# Altium project SpeedGateControl.PrjPcb (part 1 of 2)
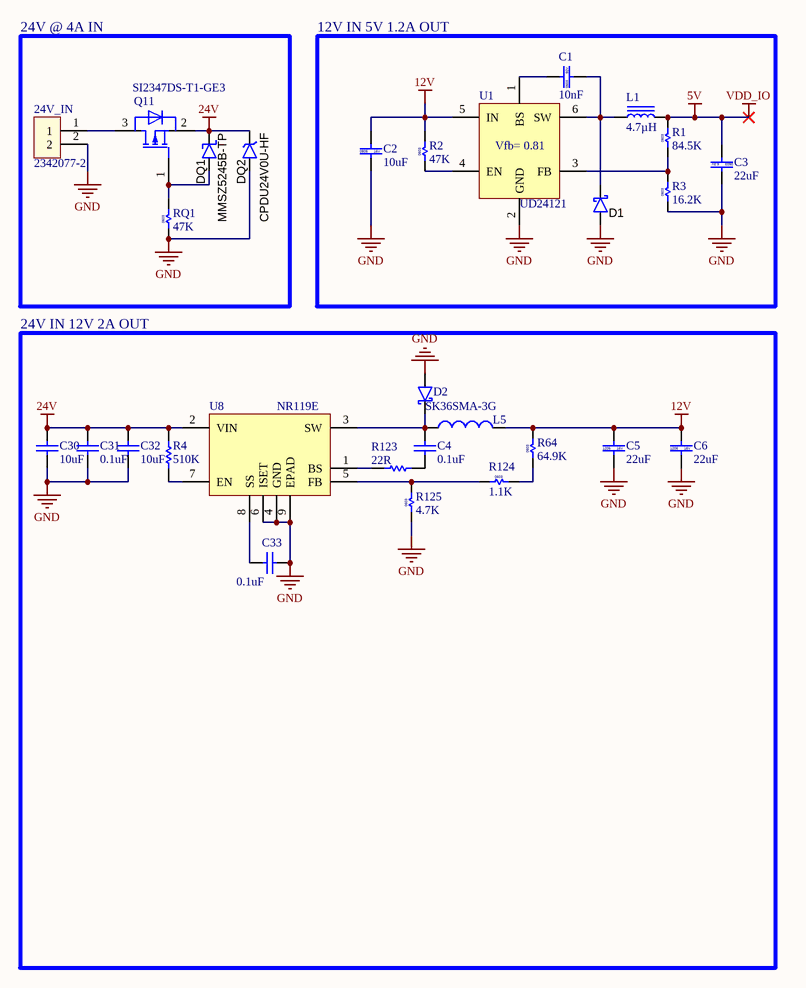
[diagram p0: 01_POWER.SchDoc]
10 sheets, 303 parts. Net scope: global (net labels, ports and power ports of the same name join across sheets).
Board file: SpeedGateControl_PCB.PcbDoc
Sheets:
  01_POWER.SchDoc
  02_CPU.SchDoc
  03_PHOTOELECTRIC_SENSOR.SchDoc
  04_GIRIS_CIKIS_EMG_BUTTONS.SchDoc
  05_FEEDBACK_OUTPUTS.SchDoc
  06_LED_OUTPUTS.SchDoc
  07_MOTOR_DRIVER_INTERFACE.SchDoc
  08_SLAVE_CARD_CONNECTOR_RJ45.SchDoc
  09_RS232.SchDoc
  10_SES.SchDoc

## Sheet 01_POWER.SchDoc
size A3

### Parts
24V_IN  2342077-2  [TERM BLOCK HDR 2POS 90DEG PITCH 3.81MM]
C1  10nF  [603C]
C2  10uF  [805C]
C3  22uF  [603C]
C4  0.1uF  [603C]
C5  22uF  [1206C]
C6  22uF  [1206C]
C30  10uF  [1206C]
C31  0.1uF  [603C]
C32  10uF  [1206C]
C33  0.1uF  [603C]
D1  1N5819HW-7-F  [SOD123]  (value not drawn)
D2  SK36SMA-3G  [DO-214AC]
DQ1  MMSZ5245B-TP  [SOD123]
DQ2  CPDU24V0U-HF  [SOD523F]
L1  4.7µH  [INDUCTOR 3mm 3mm]
L5  10uH 2.4A 59.8mOhm  [inductor_SMD6x6mm]  (value not drawn)
Q11  SI2347DS-T1-GE3  [SOT23-3]
R1  84.5K  [603R]
R2  47K  [603R]
R3  16.2K  [603R]
R4  510K  [603R]
R64  64.9K  [603R]
R123  22R  [603R]
R124  1.1K  [603R]
R125  4.7K  [603R]
RQ1  47K  [603R]
U1  UD24121  [SOT-23-6L]
U8  NR119E  [eSOIC8]

### Blocks framed on the sheet
24V @ 4A IN: 24V_IN DQ1 DQ2 Q11 RQ1
12V IN 5V 1.2A OUT: C1-C3 D1 L1 R1-R3 U1
24V IN 12V 2A OUT: C4-C6 C30-C33 D2 L5 R4 R64 R123-R125 U8

### Nets
5V: C3.2 L1.2 R1.2  [also labelled VDD_IO]
12V: C2.1 C5.1 C6.1 L5.2 R2.2 R64.2 U1.5(IN)
24V: C30.2 C31.2 C32.2 DQ1.2(K) DQ2.2 Q11.2(S) R4.2 U8.2(VIN)
GND: 24V_IN.2 C2.2 C3.1 C5.2 C6.2 C30.1 C31.1 C32.1 C33.2 D1.1(A) D2.1(A) DQ2.1 R3.1 R125.1 RQ1.1 U1.2(GND) U8.4(GND) U8.6(ISET) U8.9(EPAD)
Net24V_IN_1: 24V_IN.1 Q11.3(D)
NetC1_1: C1.1 U1.1(BS)
NetC1_2: C1.2 D1.2(K) L1.1 U1.6(SW)
NetC4_1: C4.1 D2.2(K) L5.1 U8.3(SW)
NetC4_2: C4.2 R123.1
NetC33_1: C33.1 U8.8(SS)
NetDQ1_1: DQ1.1(A) Q11.1(G) RQ1.2
NetR1_1: R1.1 R3.2 U1.3(FB)
NetR2_1: R2.1 U1.4(EN)
NetR4_1: R4.1 U8.7(EN)
NetR64_1: R64.1 R124.2
NetR123_2: R123.2 U8.1(BS)
NetR124_1: R124.1 R125.2 U8.5(FB)

### Notes on the sheet
- (in symbol CAP CER 22UF 6.3V X5R 0603) 0603
- (in symbol CAP_CER_10nF_50V_%5_ X7R_ 0603) 0603
- (in symbol CAP_CER_10uF_16V_%10_ X5R_ 0805) 0805
- (in symbol CAP_CER_22uF_16V_%20_ X5R_ 1206) 1206
- (in symbol IC REG BUCK ADJ 1.2A SOT23-6 UD24121) Vfb= 0.81
- (in symbol RES 64.9K OHM 1% 1/10W 0603) 0603
- (in symbol RES SMD 4.7K OHM 1% 1/10W 0603) 0603
- (in symbol RES_1.1K_OHM_%1_0.1W_0603) 0603
- (in symbol RES_16.2K_OHM_%1_0.1W_0603) 0603
- (in symbol RES_47K_OHM_%5_0.1W_0603) 0603
- (in symbol RES_84.5K_OHM_%1_0.1W_0603) 0603

### Library data of the parts
24V_IN = TERM BLOCK HDR 2POS 90DEG 3.81MM: 2 Position Terminal Block Header, Male Pins, Shrouded (4 Side) 0.150" (3.81mm) 90°, Right Angle - Through Hole; Manufacturer: TE Connectivity AMP Connectors; Contact Tail Length: 0.075" (1.90mm); Digi-Key Part Number: A145321-ND; Value: 2342077-2; Pitch: 0.150" (3.81mm); Header Orientation: 90°, Right Angle; Insulation Height: 0.285" (7.25mm)
C1 = CAP_CER_10nF_50V_%5_ X7R_ 0603: 10nF ±5% 50V Ceramic Capacitor X7R 0603 (1608 Metric); Manufacturer: Yageo; Manufacturer Part Number: CC0603JRX7R9BB103; Value: 10nF; Digi-Key Part Number: 311-1778-2-ND; Tolerance: ±5%; Voltage - Rated: 50V; Temperature Coefficient: X7R; Operating Temperature: -55°C ~ 125°C; Applications: General Purpose; Package / Case: 0603 (1608 Metric); Size / Dimension: 0.063" L x 0.032" W (1.60mm x 0.80mm); Thickness (Max): 0.035" (0.90mm)
C2 = CAP_CER_10uF_16V_%10_ X5R_ 0805: 10µF ±10% 16V Ceramic Capacitor X6S 0805 (2012 Metric); Manufacturer: Murata Electronics North America; Manufacturer Part Number: GRM21BC81C106KA73L; Temperature Coefficient: XS6; Value: 10uF; Digi-Key Part Number: 490-5519-1-ND; Tolerance: ±10%; Voltage - Rated: 16V; Operating Temperature: -55°C ~ 85°C; Applications: General Purpose; Package / Case: 0805 (2012 Metric); Size / Dimension: 0.079" L x 0.049" W (2.00mm x 1.25mm); Thickness (Max): 0.037" (0.95mm); Price-1: 0.24000; Price-10: 0.16100; Price-100: 0.08140; Price-1000: 0.04928
C3 = CAP CER 22UF 6.3V X5R 0603: 22 µF ±20% 6.3V Ceramic Capacitor X5R 0603 (1608 Metric); Manufacturer: CAL-CHIP ELECTRONICS, INC.; Manufacturer Part Number: GMC10X5R226M6R3NT; Value: 22uF; Digi-Key Part Number: 2571-GMC10X5R226M6R3NTTR-ND; Tolerance: ±20%; Voltage - Rated: 6.3V; Temperature Coefficient: X5R; Operating Temperature: -55°C ~ 85°C; Applications: General Purpose; Package / Case: 0603 (1608 Metric)
C4 C31 C33 = CAP CER 0.1UF 100V X7R 0603: 0.1 µF ±10% 100V Ceramic Capacitor X7R 0603 (1608 Metric); Manufacturer: Venkel; Manufacturer Part Number: C0603X7R101-104KNP; Value: 0.1uF; Digi-Key Part Number: 2679-C0603X7R101-104KNPTR-ND; Tolerance: ±10%; Voltage - Rated: 100V; Temperature Coefficient: X7R; Operating Temperature: -55°C ~ 125°C; Applications: General Purpose; Package / Case: 0603 (1608 Metric)
C5 C6 = CAP_CER_22uF_16V_%20_ X5R_ 1206: 22µF ±20% 16V Ceramic Capacitor X5R 1206 (3216 Metric); Manufacturer: Samsung Electro-Mechanics; Manufacturer Part Number: CL31A226MOCLNNC; Value: 22uF; Digi-Key Part Number: 1276-2728-1-ND; Tolerance: ±20%; Voltage - Rated: 16V; Temperature Coefficient: X5R; Operating Temperature: -55°C ~ 85°C; Applications: General Purpose; Package / Case: 1206 (3216 Metric); Size / Dimension: 0.126" L x 0.063" W (3.20mm x 1.60mm); Thickness (Max): 0.037" (0.95mm); Features: Low Profile
C30 C32 = CAP_CER_10uF_50V_%20_ X5R_ 1206: 10µF ±20% 50V Ceramic Capacitor X5R 1206 (3216 Metric); Manufacturer: Samsung Electro-Mechanics; Manufacturer Part Number: CL31A106MBHNNNE; Value: 10uF; Digi-Key Part Number: 1276-6736-1-ND; Tolerance: ±20%; Voltage - Rated: 50V; Temperature Coefficient: X5R; Operating Temperature: -55°C ~ 85°C; Applications: General Purpose; Package / Case: 1206 (3216 Metric); Size / Dimension: 0.126" L x 0.063" W (3.20mm x 1.60mm); Thickness (Max): 0.071" (1.80mm); Price-1: 0.24000; Price-10: 0.16100; Price-100: 0.08140; Price-1000: 0.04928
D1 = DIODE_SCHOTTKY_1N5819_1A_40V: Diode Schottky 40V 1A Surface Mount SOD-123; Manufacturer: Diodes Inc; Material: Si; Voltage - Forward (Vf) (Max) @ If: 450mV @ 1A; Speed: Fast Recovery =< 500ns, > 200mA (Io); Current - Reverse Leakage @ Vr: 1mA @ 40V; Capacitance @ Vr, F: 60pF @ 4V, 1MHz; Package / Case: SOD123; Diode Type: Schottky; Manufacturer Part Number: 1N5819HW-7-F; Voltage - DC Reverse (Vr) (Max): 40V; Operating Temperature - Junction: -65°C ~ 125°C; Digi-Key Part Number: 1N5819HW-FDITR-ND; Value: 1N5819HW-7-F
D2 = DIODE_SCHOTTKY SMA 60V 3A: Diode Schottky 60 V 3A Surface Mount SMA (DO-214AC); pin to pad: 1>A 2>K; Voltage - Forward (Vf) (Max) @ If: 550 mV @ 3 A; Voltage - DC Reverse (Vr) (Max): 60V; Speed: Fast Recovery =< 500ns, > 200mA (Io); Current - Reverse Leakage @ Vr: 50 µA @ 60 V; Value: SK36SMA-3G; Digi-Key Part Number: 2796-SK36SMA-3GTR-ND; Package / Case: DO-214AC, SMA; Diode Type: Schottky; Operating Temperature - Junction: -50°C ~ 150°C; Current - Average Rectified (Io): 3A
DQ1 = DIODE ZENER 15V 500MW SOD123 MMSZ5245B-TP: Zener Diode 15 V 500 mW ±5% Surface Mount SOD-123; Manufacturer: Micro Commercial Co; Voltage - Zener (Nom) (Vz): 15 V; Power - Max: 500 mW; Impedance (Max) (Zzt): 16 Ohms; Current - Reverse Leakage @ Vr: 100 nA @ 11 V; Voltage - Forward (Vf) (Max) @ If: 900 mV @ 10 mA; Digi-Key Part Number: MMSZ5245B-TPMSCT-ND; Manufacturer Part Number: MMSZ5245B-TP; Tolerance: ±5%; Operating Temperature: -55°C ~ 150°C; Package / Case: SOD-123; Value: MMSZ5245B-TP
DQ2 = TVS DIODE 24VWM 50V 0603/SOD523F CPDU24V0U-HF: 50V Clamp 3A (8/20µs) Ipp Tvs Diode Surface Mount 0603/SOD-523F; Manufacturer: Comchip Technology; Voltage - Reverse Standoff (Typ): 24V (Max); Voltage - Breakdown (Min): 26.5V; Power - Peak Pulse: 150W; Power Line Protection: No; Unidirectional Channels: 1; Digi-Key Part Number: 641-1679-1-ND; Manufacturer Part Number: CPDU24V0U-HF; Type: Zener; Voltage - Clamping (Max) @ Ipp: 50V; Operating Temperature: -55°C ~ 125°C (TJ); Package / Case: 0603/SOD-523F; Value: CPDU24V0U-HF
L1 = FIXED IND 4.7UH 1A 120 MOHM 3mm x 3mm SMD LQH3NPN4R7MMEL: 4.7 µH Shielded Drum Core, Wirewound Inductor 1 A 120mOhm Max 1212 (3030 Metric); Manufacturer: Murata Electronics; Current Rating: 1A; Material - Core: Ferrite; Current - Saturation (Isat): 1.3A; Digi-Key Part Number: 490-15954-1-ND; Inductance: 4.7µH; Package / Case: 1212 (3030 Metric); DC Resistance (DCR): 120mOhm Max; Size / Dimension: 0.118" L x 0.118" W (3.00mm x 3.00mm); Height - Seated (Max): 0.059" (1.50mm); Type: Drum Core, Wirewound
L5 = FIXED IND 10UH 2.4A 59.8MOHM SMD: 10 µH Shielded Wirewound Inductor 2.4 A 59.8mOhm Max Nonstandard; Manufacturer: Taiyo Yuden; Manufacturer Part Number: NRS6045T100MMGK; Material - Core: Ferrite; Tolerance: ±20%; Frequency - Self Resonan: 12MHz; Current - Saturation: 3.1A; Frequency - Test: 100 kHz; Inductance: 10 µH; Operating Temperature: -55°C ~ 125°C; Package / Case: Nonstandard; Height (Max): 0.177" (4.50mm); Size / Dimension: 0.236" L x 0.236" W (6.00mm x 6.00mm); Digi-Key Part Number: 587-2946-1-ND; DC Resistance (DCR) (Max): 59.8mOhm; Value: 10uH 2.4A 59.8mOhm; Current Rating (Max): 2.4A; Shielding: Shielded
Q11 = MOSFET P-CH 30V 5A SOT23-3 SI2347DS-T1-GE3: P-Channel 30 V 5A (Tc) 1.7W (Tc) Surface Mount SOT-23-3 (TO-236); Manufacturer: Vishay Siliconix; Drain to Source Voltage (Vdss): 30 V; Current - Continuous Drain (Id) @ 25°C: 5A (Tc); Drive Voltage (Max Rds On, Min Rds On): 4.5V, 10V; Rds On (Max) @ Id, Vgs: 42mOhm @ 3.8A, 10V; Vgs (Max): ±20V; Digi-Key Part Number: SI2347DS-T1-GE3CT-ND; Value: SI2347DS-T1-GE3; Power Dissipation (Max): 1.7W (Tc); Operating Temperature: -55°C ~ 150°C (TJ); Package / Case: TO-236-3, SC-59, SOT-23-3
R1 = RES_84.5K_OHM_%1_0.1W_0603: 84.5 kOhms ±1% 0.1W, 1/10W Chip Resistor 0603 (1608 Metric) Moisture Resistant Thick Film; Manufacturer: Yageo; Manufacturer Part Number: RC0603FR-0784K5L; Temperature Coefficient: ±100ppm/°C; Value: 84.5K; Digi-Key Part Number: 311-84.5KHRCT-ND; Tolerance: ±1%; Power (Watts): 0.1W, 1/10W; Composition: Thick Film; Operating Temperature: -55°C ~ 155°C; Package / Case: 0603 (1608 Metric); Size / Dimension: 0.063" L x 0.032" W (1.60mm x 0.80mm); Height - Seated (Max): 0.022" (0.55mm); Features: Moisture Resistant
R2 RQ1 = RES_47K_OHM_%5_0.1W_0603: 47 kOhms ±5% 0.1W, 1/10W Chip Resistor 0603 (1608 Metric) Moisture Resistant Thick Film; Manufacturer: Yageo; Manufacturer Part Number: RC0603JR-0747KL; Temperature Coefficient: ±100ppm/°C; Value: 47K; Digi-Key Part Number: 311-47KGRTR-ND; Tolerance: ±5%; Power (Watts): 0.1W, 1/10W; Composition: Thick Film; Operating Temperature: -55°C ~ 155°C; Package / Case: 0603 (1608 Metric); Size / Dimension: 0.063" L x 0.032" W (1.60mm x 0.80mm); Height - Seated (Max): 0.022" (0.55mm); Features: Moisture Resistant
R3 = RES_16.2K_OHM_%1_0.1W_0603: 16.2 kOhms ±1% 0.1W, 1/10W Chip Resistor 0603 (1608 Metric) Moisture Resistant Thick Film; Manufacturer: Yageo; Manufacturer Part Number: RC0603FR-0716K2L; Temperature Coefficient: ±100ppm/°C; Value: 16.2K; Digi-Key Part Number: 311-16.2KHRTR-ND; Tolerance: ±1%; Power (Watts): 0.1W, 1/10W; Composition: Thick Film; Operating Temperature: -55°C ~ 155°C; Package / Case: 0603 (1608 Metric); Size / Dimension: 0.063" L x 0.032" W (1.60mm x 0.80mm); Height - Seated (Max): 0.022" (0.55mm); Features: Moisture Resistant
R4 = RES 510K OHM 5% 1/10W 0603: 510 kOhms ±5% 0.1W, 1/10W Chip Resistor 0603 (1608 Metric) Automotive AEC-Q200, Moisture Resistant Thick Film; Manufacturer: KOA Speer Electronics, Inc.; Manufacturer Part Number: RK73B1JTTD514J; Temperature Coefficient: ±200ppm/°C; Value: 510K; Digi-Key Part Number: 2019-RK73B1JTTD514JTR-ND; Tolerance: ±5%; Power (Watts): 0.1W, 1/10W; Composition: Thick Film; Operating Temperature: -55°C ~ 155°C; Package / Case: 0603 (1608 Metric); Size / Dimension: 0.063" L x 0.032" W (1.60mm x 0.80mm); Height - Seated (Max): 0.022" (0.55mm); Features: Automotive AEC-Q200, Moisture Resistant
R64 = RES 64.9K OHM 1% 1/10W 0603: 64.9 kOhms ±1% 0.1W, 1/10W Chip Resistor 0603 (1608 Metric) Moisture Resistant Thick Film; Manufacturer: YAGEO; Manufacturer Part Number: RC0603FR-0764K9L; Temperature Coefficient: ±100ppm/°C; Value: 64.9K; Digi-Key Part Number: 311-64.9KHRCT-ND; Tolerance: ±1%; Power (Watts): 0.1W, 1/10W; Composition: Thick Film; Operating Temperature: -55°C ~ 155°C; Package / Case: 0603 (1608 Metric); Size / Dimension: 0.063" L x 0.032" W (1.60mm x 0.80mm); Height - Seated (Max): 0.022" (0.55mm); Features: Moisture Resistant
R123 = RES_22 OHM 5% 1/10W 0603: 22 Ohms ±5% 0.1W, 1/10W Chip Resistor 0603 (1608 Metric) Automotive AEC-Q200 Thick Film; Temperature Coefficient: ±200ppm/°C; Value: 22R; Digi-Key Part Number: RMCF0603JT22R0TR-ND; Tolerance: ±5%; Power (Watts): 0.1W, 1/10W; Operating Temperature: -55°C ~ 155°C; Package / Case: 0603 (1608 Metric)
R124 = RES_1.1K_OHM_%1_0.1W_0603: 1.1 kOhms ±1% 0.1W, 1/10W Chip Resistor 0603 (1608 Metric) Moisture Resistant Thick Film; Manufacturer: Yageo; Manufacturer Part Number: RC0603FR-071K1L; Temperature Coefficient: ±100ppm/°C; Value: 1.1K; Digi-Key Part Number: 311-1.10KHRCT-ND; Tolerance: ±1%; Power (Watts): 0.1W, 1/10W; Composition: Thick Film; Operating Temperature: -55°C ~ 155°C; Package / Case: 0603 (1608 Metric); Size / Dimension: 0.063" L x 0.032" W (1.60mm x 0.80mm); Height - Seated (Max): 0.022" (0.55mm); Features: Moisture Resistant
R125 = RES SMD 4.7K OHM 1% 1/10W 0603: 4.7 kOhms ±1% 0.1W, 1/10W Chip Resistor 0603 (1608 Metric)  Thick Film; Temperature Coefficient: ±100ppm/°C; Value: 4.7K; Digi-Key Part Number: 311-4.70KHRCT-ND; Tolerance: ±1%; Power (Watts): 0.1W, 1/10W; Operating Temperature: -55°C ~ 155°C; Package / Case: 0603 (1608 Metric)
U1 = IC REG BUCK ADJ 1.2A SOT23-6 UD24121: 1.2A, 24V, 1.4MHz STEP-DOWN CONVERTER; Manufacturer: UNISONIC TECHNOLOGIES CO., LTD; Voltage - Input (Max): 4.5 ~ 24V; Voltage - Output (Max): 0.81 ~ 15V; Control Features: Enable; Voltage - Input (Min): 4.5V; Number of Outputs: 1; Output Type: Adjustable; Digi-Key Part Number: https://ozdisan.com/integrated-circuits-ics/power-management-ics/dc-dc-switching-voltage-regulators/UD24121G-AG6-R/498894; Manufacturer Part Number: UD24121; Current - Output: 1.2A; Operating Temperature: -40°C ~ 85°C (TA); Package / Case: SOT-23-6; Supplier Device Package: SOT-23-6; Value: UD24121; Frequency - Switching: 1.4MHz; Function: Step-Down
U8 = IC REG BUCK ADJUSTABLE 2A 8SOIC NR119E: Buck Switching Regulator IC Positive Adjustable 0.8V 1 Output 2A 8-SOIC (0.154", 3.90mm Width) Exposed Pad; Manufacturer: Sanken; Voltage - Input (Min): 6.5V; Voltage - Input (Max): 31V; Voltage - Output (Max): 24V; Frequency - Switching: 364kHz; Function: Step-Down; Digi-Key Part Number: NR119ECT-ND; Manufacturer Part Number: NR119E; Voltage - Output (Min/Fixed): 0.8V; Current - Output: 2A; Operating Temperature: -40°C ~ 85°C (TA); Package / Case: 8-SOIC (0.154", 3.90mm Width) Exposed Pad; Supplier Device Package: 8-SOIC-EP; Value: NR119E

## Sheet 02_CPU.SchDoc
size A3
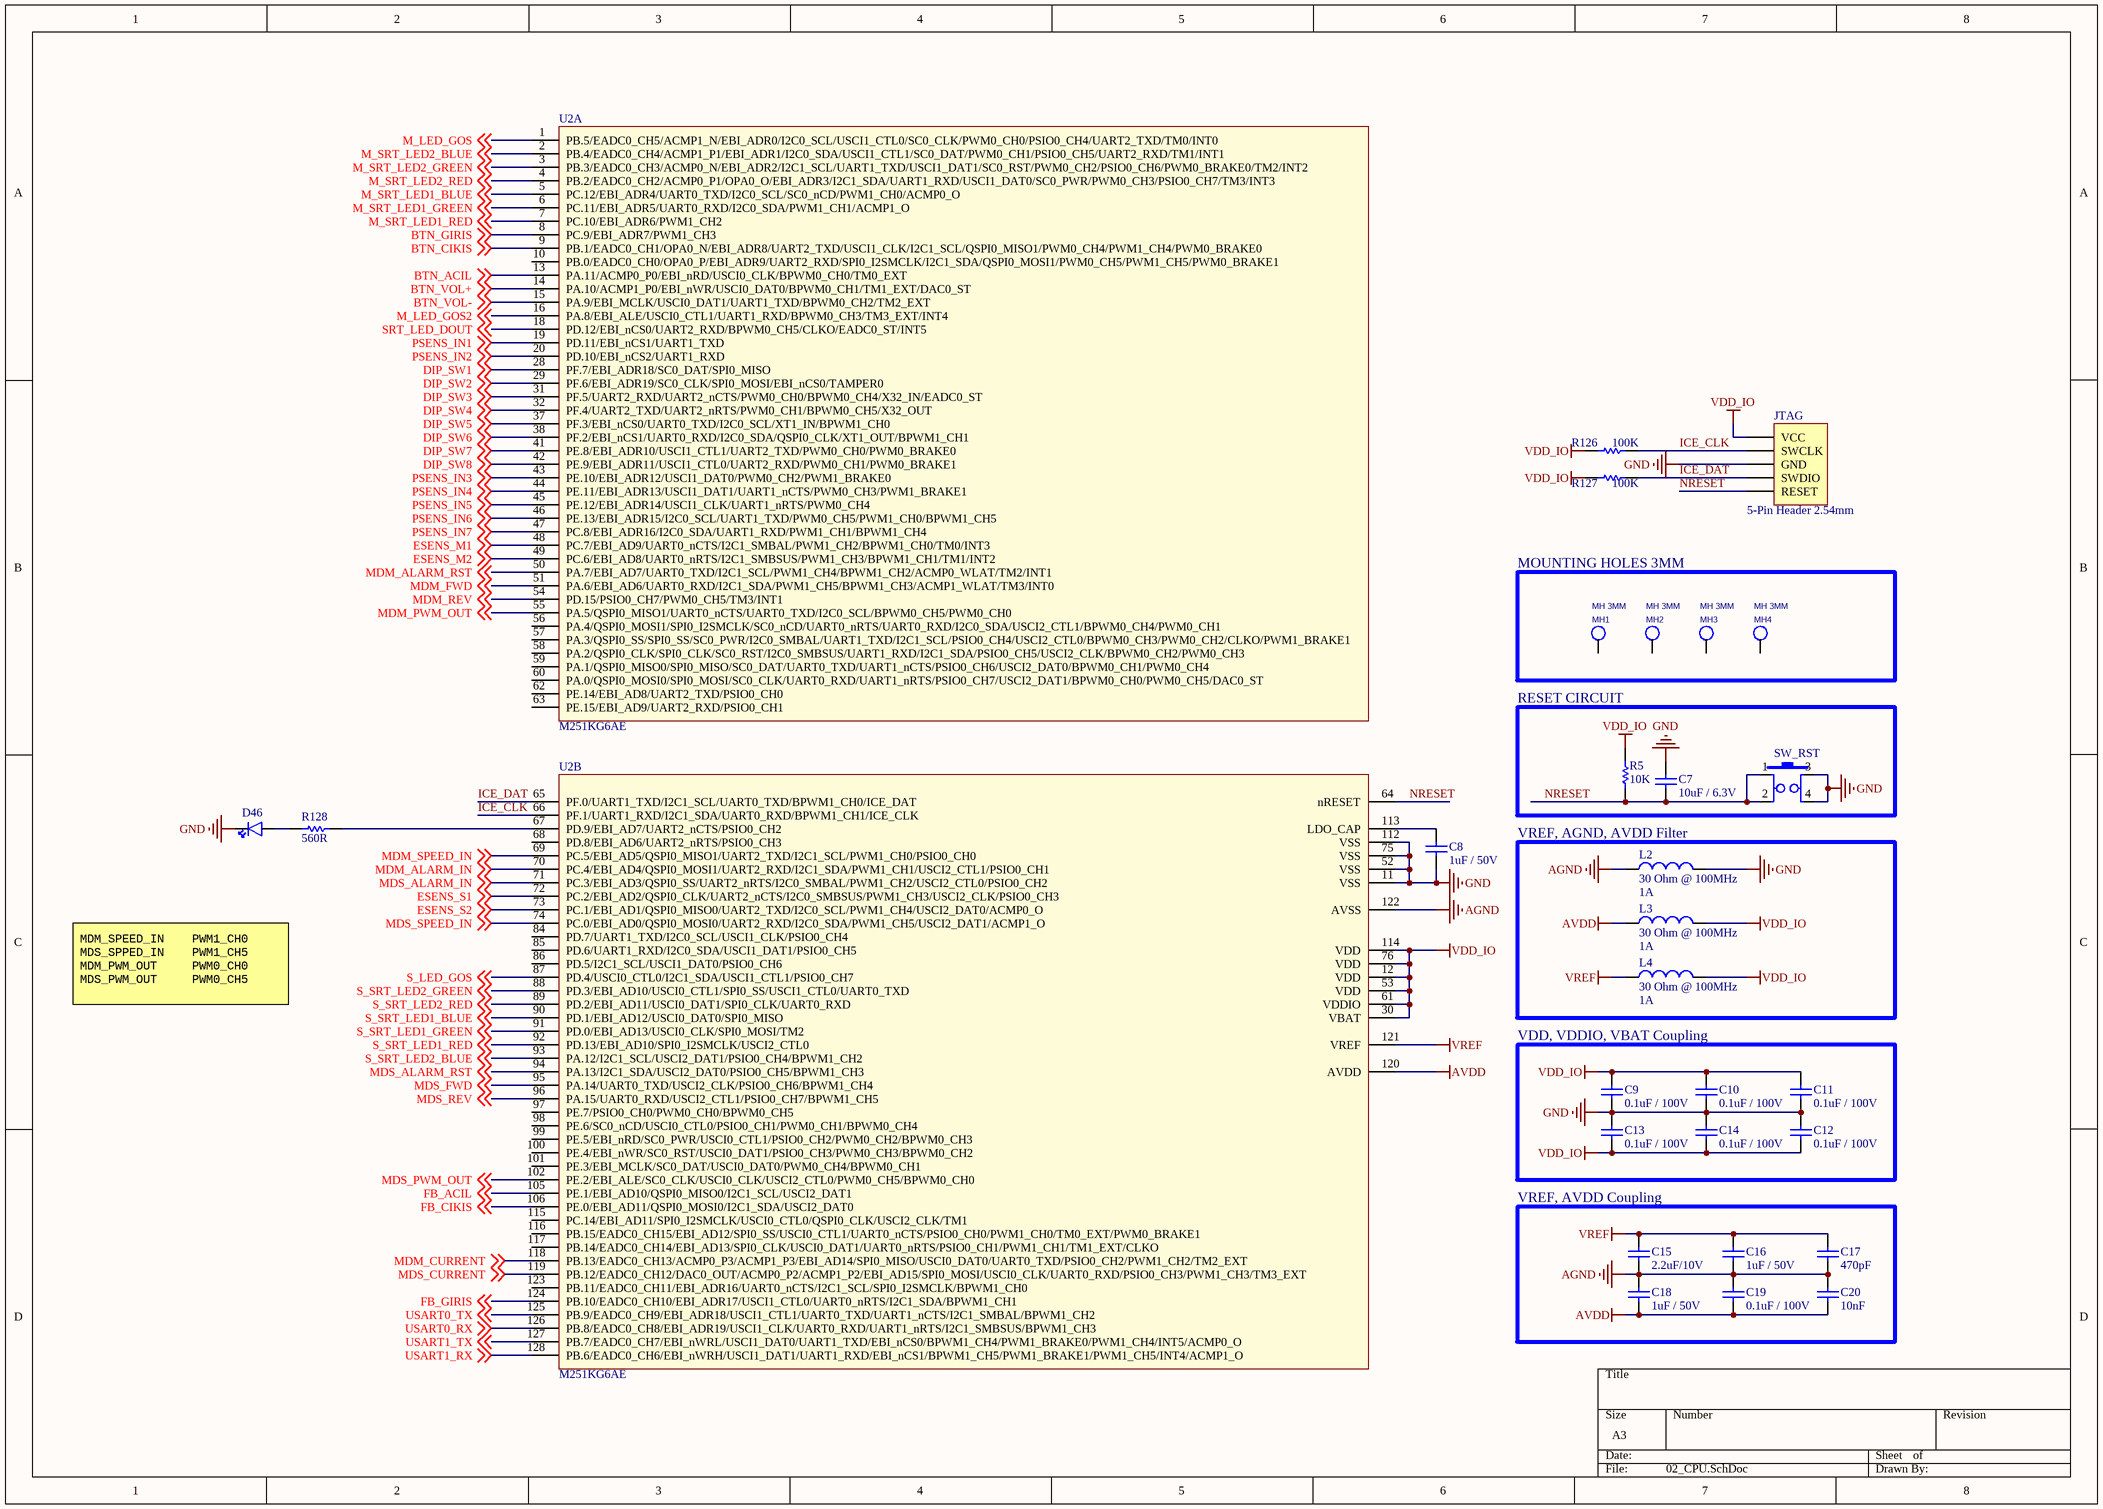
[diagram p1: 02_CPU.SchDoc]

### Parts
C7  10uF / 6.3V  [603C]
C8  1uF / 50V  [603C]
C9  0.1uF / 100V  [603C]
C10  0.1uF / 100V  [603C]
C11  0.1uF / 100V  [603C]
C12  0.1uF / 100V  [603C]
C13  0.1uF / 100V  [603C]
C14  0.1uF / 100V  [603C]
C15  2.2uF/10V  [603C]
C16  1uF / 50V  [603C]
C17  470pF  [603C]
C18  1uF / 50V  [603C]
C19  0.1uF / 100V  [603C]
C20  10nF  [603C]
D46  led_green  [805LED]  (value not drawn)
JTAG  5-Pin Header 2.54mm  [HDR1X5]  (no BOM)
L2  Current Rating (Max): 1A  [603L]  (hidden comment: 30 Ohm @ 100MHz)
L3  Current Rating (Max): 1A  [603L]  (hidden comment: 30 Ohm @ 100MHz)
L4  Current Rating (Max): 1A  [603L]  (hidden comment: 30 Ohm @ 100MHz)
MH1  MH 3MM  [MH 3.0MM HOLE 5MM PAD]  (no BOM)
MH2  MH 3MM  [MH 3.0MM HOLE 5MM PAD]  (no BOM)
MH3  MH 3MM  [MH 3.0MM HOLE 5MM PAD]  (no BOM)
MH4  MH 3MM  [MH 3.0MM HOLE 5MM PAD]  (no BOM)
R5  10K  [603R]
R126  100K  [603R]
R127  100K  [603R]
R128  560R  [603R]
SW_RST  switch tactile  [SW_TACTILE_6X6mm SMT]  (value not drawn)
U2  M251KG6AE  [TSQFP40P1600X1600X160-128N]  (parts A,B of 2)

### Blocks framed on the sheet
MOUNTING HOLES 3MM: MH1-MH4
RESET CIRCUIT: C7 R5 SW_RST
VREF, AGND, AVDD Filter: L2-L4
VDD, VDDIO, VBAT Coupling: C9-C14
VREF, AVDD Coupling: C15-C20

### Nets
AGND: C15.1 C16.1 C17.1 C18.2 C19.2 C20.2 L2.1 U2.122(AVSS)
AVDD: C18.1 C19.1 C20.1 L3.1 U2.120(AVDD)
GND: C7.1 C8.1 C9.1 C10.1 C11.1 C12.1 C13.2 C14.2 D46.2(K) JTAG.3(GND) L2.2 SW_RST.3 SW_RST.4 U2.11(VSS) U2.52(VSS) U2.75(VSS) U2.112(VSS)
VDD_IO: C9.2 C10.2 C11.2 C12.2 C13.1 C14.1 JTAG.1(VCC) L3.2 L4.2 R5.2 R126.1 R127.1 U2.12(VDD) U2.30(VBAT) U2.53(VDD) U2.61(VDDIO) U2.76(VDD) U2.114(VDD)  [project net 5V]
VREF: C15.2 C16.2 C17.2 L4.1 U2.121(VREF)
BTN_ACIL: U2.13(PA.11/ACMP0_P0/EBI_nRD/USCI0_CLK/BPWM0_CH0/TM0_EXT) ; off-sheet BTN_ACIL
BTN_CIKIS: U2.9(PB.1/EADC0_CH1/OPA0_N/EBI_ADR8/UART2_TXD/USCI1_CLK/I2C1_SCL/QSPI0_MISO1/PWM0_CH4/PWM1_CH4/PWM0_BRAKE0) ; off-sheet BTN_CIKIS
BTN_GIRIS: U2.8(PC.9/EBI_ADR7/PWM1_CH3) ; off-sheet BTN_GIRIS
BTN_VOL+: U2.14(PA.10/ACMP1_P0/EBI_nWR/USCI0_DAT0/BPWM0_CH1/TM1_EXT/DAC0_ST) ; off-sheet BTN_VOL+
BTN_VOL-: U2.15(PA.9/EBI_MCLK/USCI0_DAT1/UART1_TXD/BPWM0_CH2/TM2_EXT) ; off-sheet BTN_VOL-
DIP_SW1: U2.28(PF.7/EBI_ADR18/SC0_DAT/SPI0_MISO) ; off-sheet DIP_SW1
DIP_SW2: U2.29(PF.6/EBI_ADR19/SC0_CLK/SPI0_MOSI/EBI_nCS0/TAMPER0) ; off-sheet DIP_SW2
DIP_SW3: U2.31(PF.5/UART2_RXD/UART2_nCTS/PWM0_CH0/BPWM0_CH4/X32_IN/EADC0_ST) ; off-sheet DIP_SW3
DIP_SW4: U2.32(PF.4/UART2_TXD/UART2_nRTS/PWM0_CH1/BPWM0_CH5/X32_OUT) ; off-sheet DIP_SW4
DIP_SW5: U2.37(PF.3/EBI_nCS0/UART0_TXD/I2C0_SCL/XT1_IN/BPWM1_CH0) ; off-sheet DIP_SW5
DIP_SW6: U2.38(PF.2/EBI_nCS1/UART0_RXD/I2C0_SDA/QSPI0_CLK/XT1_OUT/BPWM1_CH1) ; off-sheet DIP_SW6
DIP_SW7: U2.41(PE.8/EBI_ADR10/USCI1_CTL1/UART2_TXD/PWM0_CH0/PWM0_BRAKE0) ; off-sheet DIP_SW7
DIP_SW8: U2.42(PE.9/EBI_ADR11/USCI1_CTL0/UART2_RXD/PWM0_CH1/PWM0_BRAKE1) ; off-sheet DIP_SW8
ESENS_M1: U2.48(PC.7/EBI_AD9/UART0_nCTS/I2C1_SMBAL/PWM1_CH2/BPWM1_CH0/TM0/INT3) ; off-sheet ESENS_M1
ESENS_M2: U2.49(PC.6/EBI_AD8/UART0_nRTS/I2C1_SMBSUS/PWM1_CH3/BPWM1_CH1/TM1/INT2) ; off-sheet ESENS_M2
ESENS_S1: U2.72(PC.2/EBI_AD2/QSPI0_CLK/UART2_nCTS/I2C0_SMBSUS/PWM1_CH3/USCI2_CLK/PSIO0_CH3) ; off-sheet ESENS_S1
ESENS_S2: U2.73(PC.1/EBI_AD1/QSPI0_MISO0/UART2_TXD/I2C0_SCL/PWM1_CH4/USCI2_DAT0/ACMP0_O) ; off-sheet ESENS_S2
FB_ACIL: U2.105(PE.1/EBI_AD10/QSPI0_MISO0/I2C1_SCL/USCI2_DAT1) ; off-sheet FB_ACIL
FB_CIKIS: U2.106(PE.0/EBI_AD11/QSPI0_MOSI0/I2C1_SDA/USCI2_DAT0) ; off-sheet FB_CIKIS
FB_GIRIS: U2.124(PB.10/EADC0_CH10/EBI_ADR17/USCI1_CTL0/UART0_nRTS/I2C1_SDA/BPWM1_CH1) ; off-sheet FB_GIRIS
ICE_CLK: JTAG.2(SWCLK) R126.2 U2.66(PF.1/UART1_RXD/I2C1_SDA/UART0_RXD/BPWM1_CH1/ICE_CLK)
ICE_DAT: JTAG.4(SWDIO) R127.2 U2.65(PF.0/UART1_TXD/I2C1_SCL/UART0_TXD/BPWM1_CH0/ICE_DAT)
M_LED_GOS: U2.1(PB.5/EADC0_CH5/ACMP1_N/EBI_ADR0/I2C0_SCL/USCI1_CTL0/SC0_CLK/PWM0_CH0/PSIO0_CH4/UART2_TXD/TM0/INT0) ; off-sheet M_LED_GOS
M_LED_GOS2: U2.16(PA.8/EBI_ALE/USCI0_CTL1/UART1_RXD/BPWM0_CH3/TM3_EXT/INT4) ; off-sheet M_LED_GOS2
M_SRT_LED1_BLUE: U2.5(PC.12/EBI_ADR4/UART0_TXD/I2C0_SCL/SC0_nCD/PWM1_CH0/ACMP0_O) ; off-sheet M_SRT_LED1_BLUE
M_SRT_LED1_GREEN: U2.6(PC.11/EBI_ADR5/UART0_RXD/I2C0_SDA/PWM1_CH1/ACMP1_O) ; off-sheet M_SRT_LED1_GREEN
M_SRT_LED1_RED: U2.7(PC.10/EBI_ADR6/PWM1_CH2) ; off-sheet M_SRT_LED1_RED
M_SRT_LED2_BLUE: U2.2(PB.4/EADC0_CH4/ACMP1_P1/EBI_ADR1/I2C0_SDA/USCI1_CTL1/SC0_DAT/PWM0_CH1/PSIO0_CH5/UART2_RXD/TM1/INT1) ; off-sheet M_SRT_LED2_BLUE
M_SRT_LED2_GREEN: U2.3(PB.3/EADC0_CH3/ACMP0_N/EBI_ADR2/I2C1_SCL/UART1_TXD/USCI1_DAT1/SC0_RST/PWM0_CH2/PSIO0_CH6/PWM0_BRAKE0/TM2/INT2) ; off-sheet M_SRT_LED2_GREEN
M_SRT_LED2_RED: U2.4(PB.2/EADC0_CH2/ACMP0_P1/OPA0_O/EBI_ADR3/I2C1_SDA/UART1_RXD/USCI1_DAT0/SC0_PWR/PWM0_CH3/PSIO0_CH7/TM3/INT3) ; off-sheet M_SRT_LED2_RED
MDM_ALARM_IN: U2.70(PC.4/EBI_AD4/QSPI0_MOSI1/UART2_RXD/I2C1_SDA/PWM1_CH1/USCI2_CTL1/PSIO0_CH1) ; off-sheet MDM_ALARM_IN
MDM_ALARM_RST: U2.50(PA.7/EBI_AD7/UART0_TXD/I2C1_SCL/PWM1_CH4/BPWM1_CH2/ACMP0_WLAT/TM2/INT1) ; off-sheet MDM_ALARM_RST
MDM_CURRENT: U2.118(PB.13/EADC0_CH13/ACMP0_P3/ACMP1_P3/EBI_AD14/SPI0_MISO/USCI0_DAT0/UART0_TXD/PSIO0_CH2/PWM1_CH2/TM2_EXT) ; off-sheet MDM_CURRENT
MDM_FWD: U2.51(PA.6/EBI_AD6/UART0_RXD/I2C1_SDA/PWM1_CH5/BPWM1_CH3/ACMP1_WLAT/TM3/INT0) ; off-sheet MDM_FWD
MDM_PWM_OUT: U2.55(PA.5/QSPI0_MISO1/UART0_nCTS/UART0_TXD/I2C0_SCL/BPWM0_CH5/PWM0_CH0) ; off-sheet MDM_PWM_OUT
MDM_REV: U2.54(PD.15/PSIO0_CH7/PWM0_CH5/TM3/INT1) ; off-sheet MDM_REV
MDM_SPEED_IN: U2.69(PC.5/EBI_AD5/QSPI0_MISO1/UART2_TXD/I2C1_SCL/PWM1_CH0/PSIO0_CH0) ; off-sheet MDM_SPEED_IN
MDS_ALARM_IN: U2.71(PC.3/EBI_AD3/QSPI0_SS/UART2_nRTS/I2C0_SMBAL/PWM1_CH2/USCI2_CTL0/PSIO0_CH2) ; off-sheet MDS_ALARM_IN
MDS_ALARM_RST: U2.94(PA.13/I2C1_SDA/USCI2_DAT0/PSIO0_CH5/BPWM1_CH3) ; off-sheet MDS_ALARM_RST
MDS_CURRENT: U2.119(PB.12/EADC0_CH12/DAC0_OUT/ACMP0_P2/ACMP1_P2/EBI_AD15/SPI0_MOSI/USCI0_CLK/UART0_RXD/PSIO0_CH3/PWM1_CH3/TM3_EXT) ; off-sheet MDS_CURRENT
MDS_FWD: U2.95(PA.14/UART0_TXD/USCI2_CLK/PSIO0_CH6/BPWM1_CH4) ; off-sheet MDS_FWD
MDS_PWM_OUT: U2.102(PE.2/EBI_ALE/SC0_CLK/USCI0_CLK/USCI2_CTL0/PWM0_CH5/BPWM0_CH0) ; off-sheet MDS_PWM_OUT
MDS_REV: U2.96(PA.15/UART0_RXD/USCI2_CTL1/PSIO0_CH7/BPWM1_CH5) ; off-sheet MDS_REV
MDS_SPEED_IN: U2.74(PC.0/EBI_AD0/QSPI0_MOSI0/UART2_RXD/I2C0_SDA/PWM1_CH5/USCI2_DAT1/ACMP1_O) ; off-sheet MDS_SPEED_IN
NRESET: C7.2 JTAG.5(RESET) R5.1 SW_RST.1 SW_RST.2 U2.64(nRESET)
PSENS_IN1: U2.19(PD.11/EBI_nCS1/UART1_TXD) ; off-sheet PSENS_IN1
PSENS_IN2: U2.20(PD.10/EBI_nCS2/UART1_RXD) ; off-sheet PSENS_IN2
PSENS_IN3: U2.43(PE.10/EBI_ADR12/USCI1_DAT0/PWM0_CH2/PWM1_BRAKE0) ; off-sheet PSENS_IN3
PSENS_IN4: U2.44(PE.11/EBI_ADR13/USCI1_DAT1/UART1_nCTS/PWM0_CH3/PWM1_BRAKE1) ; off-sheet PSENS_IN4
PSENS_IN5: U2.45(PE.12/EBI_ADR14/USCI1_CLK/UART1_nRTS/PWM0_CH4) ; off-sheet PSENS_IN5
PSENS_IN6: U2.46(PE.13/EBI_ADR15/I2C0_SCL/UART1_TXD/PWM0_CH5/PWM1_CH0/BPWM1_CH5) ; off-sheet PSENS_IN6
PSENS_IN7: U2.47(PC.8/EBI_ADR16/I2C0_SDA/UART1_RXD/PWM1_CH1/BPWM1_CH4) ; off-sheet PSENS_IN7
S_LED_GOS: U2.87(PD.4/USCI0_CTL0/I2C1_SDA/USCI1_CTL1/PSIO0_CH7) ; off-sheet S_LED_GOS
S_SRT_LED1_BLUE: U2.90(PD.1/EBI_AD12/USCI0_DAT0/SPI0_MISO) ; off-sheet S_SRT_LED1_BLUE
S_SRT_LED1_GREEN: U2.91(PD.0/EBI_AD13/USCI0_CLK/SPI0_MOSI/TM2) ; off-sheet S_SRT_LED1_GREEN
S_SRT_LED1_RED: U2.92(PD.13/EBI_AD10/SPI0_I2SMCLK/USCI2_CTL0) ; off-sheet S_SRT_LED1_RED
S_SRT_LED2_BLUE: U2.93(PA.12/I2C1_SCL/USCI2_DAT1/PSIO0_CH4/BPWM1_CH2) ; off-sheet S_SRT_LED2_BLUE
S_SRT_LED2_GREEN: U2.88(PD.3/EBI_AD10/USCI0_CTL1/SPI0_SS/USCI1_CTL0/UART0_TXD) ; off-sheet S_SRT_LED2_GREEN
S_SRT_LED2_RED: U2.89(PD.2/EBI_AD11/USCI0_DAT1/SPI0_CLK/UART0_RXD) ; off-sheet S_SRT_LED2_RED
SRT_LED_DOUT: U2.18(PD.12/EBI_nCS0/UART2_RXD/BPWM0_CH5/CLKO/EADC0_ST/INT5) ; off-sheet SRT_LED_DOUT
USART0_RX: U2.126(PB.8/EADC0_CH8/EBI_ADR19/USCI1_CLK/UART0_RXD/UART1_nRTS/I2C1_SMBSUS/BPWM1_CH3) ; off-sheet USART0_RX
USART0_TX: U2.125(PB.9/EADC0_CH9/EBI_ADR18/USCI1_CTL1/UART0_TXD/UART1_nCTS/I2C1_SMBAL/BPWM1_CH2) ; off-sheet USART0_TX
USART1_RX: U2.128(PB.6/EADC0_CH6/EBI_nWRH/USCI1_DAT1/UART1_RXD/EBI_nCS1/BPWM1_CH5/PWM1_BRAKE1/PWM1_CH5/INT4/ACMP1_O) ; off-sheet USART1_RX
USART1_TX: U2.127(PB.7/EADC0_CH7/EBI_nWRL/USCI1_DAT0/UART1_TXD/EBI_nCS0/BPWM1_CH4/PWM1_BRAKE0/PWM1_CH4/INT5/ACMP0_O) ; off-sheet USART1_TX
NetC8_2: C8.2 U2.113(LDO_CAP)
NetD46_1: D46.1(A) R128.2
NetR128_1: R128.1 U2.67(PD.9/EBI_AD7/UART2_nCTS/PSIO0_CH2)

Not connected (* = marked no-connect by the designer): MH1 1; MH2 1; MH3 1; MH4 1; U2 10(PB.0/EADC0_CH0/OPA0_P/EBI_ADR9/UART2_RXD/SPI0_I2SMCLK/I2C1_SDA/QSPI0_MOSI1/PWM0_CH5/PWM1_CH5/PWM0_BRAKE1) 56(PA.4/QSPI0_MOSI1/SPI0_I2SMCLK/SC0_nCD/UART0_nRTS/UART0_RXD/I2C0_SDA/USCI2_CTL1/BPWM0_CH4/PWM0_CH1) 57(PA.3/QSPI0_SS/SPI0_SS/SC0_PWR/I2C0_SMBAL/UART1_TXD/I2C1_SCL/PSIO0_CH4/USCI2_CTL0/BPWM0_CH3/PWM0_CH2/CLKO/PWM1_BRAKE1) 58(PA.2/QSPI0_CLK/SPI0_CLK/SC0_RST/I2C0_SMBSUS/UART1_RXD/I2C1_SDA/PSIO0_CH5/USCI2_CLK/BPWM0_CH2/PWM0_CH3) 59(PA.1/QSPI0_MISO0/SPI0_MISO/SC0_DAT/UART0_TXD/UART1_nCTS/PSIO0_CH6/USCI2_DAT0/BPWM0_CH1/PWM0_CH4) 60(PA.0/QSPI0_MOSI0/SPI0_MOSI/SC0_CLK/UART0_RXD/UART1_nRTS/PSIO0_CH7/USCI2_DAT1/BPWM0_CH0/PWM0_CH5/DAC0_ST) 62(PE.14/EBI_AD8/UART2_TXD/PSIO0_CH0) 63(PE.15/EBI_AD9/UART2_RXD/PSIO0_CH1) 68(PD.8/EBI_AD6/UART2_nRTS/PSIO0_CH3) 84(PD.7/UART1_TXD/I2C0_SCL/USCI1_CLK/PSIO0_CH4) 85(PD.6/UART1_RXD/I2C0_SDA/USCI1_DAT1/PSIO0_CH5) 86(PD.5/I2C1_SCL/USCI1_DAT0/PSIO0_CH6) 97(PE.7/PSIO0_CH0/PWM0_CH0/BPWM0_CH5) 98(PE.6/SC0_nCD/USCI0_CTL0/PSIO0_CH1/PWM0_CH1/BPWM0_CH4) 99(PE.5/EBI_nRD/SC0_PWR/USCI0_CTL1/PSIO0_CH2/PWM0_CH2/BPWM0_CH3) 100(PE.4/EBI_nWR/SC0_RST/USCI0_DAT1/PSIO0_CH3/PWM0_CH3/BPWM0_CH2) 101(PE.3/EBI_MCLK/SC0_DAT/USCI0_DAT0/PWM0_CH4/BPWM0_CH1) 115(PC.14/EBI_AD11/SPI0_I2SMCLK/USCI0_CTL0/QSPI0_CLK/USCI2_CLK/TM1) 116(PB.15/EADC0_CH15/EBI_AD12/SPI0_SS/USCI0_CTL1/UART0_nCTS/PSIO0_CH0/PWM1_CH0/TM0_EXT/PWM0_BRAKE1) 117(PB.14/EADC0_CH14/EBI_AD13/SPI0_CLK/USCI0_DAT1/UART0_nRTS/PSIO0_CH1/PWM1_CH1/TM1_EXT/CLKO) 123(PB.11/EADC0_CH11/EBI_ADR16/UART0_nCTS/I2C1_SCL/SPI0_I2SMCLK/BPWM1_CH0)

### Notes on the sheet
- MDM_SPEED_IN    PWM1_CH0
  MDS_SPPED_IN    PWM1_CH5
  MDM_PWM_OUT     PWM0_CH0
  MDS_PWM_OUT     PWM0_CH5

### Library data of the parts
C7 = CAP_CER 10UF 6.3V X5R 0603: 10µF ±20% 6.3V Ceramic Capacitor X5R 0603 (1608 Metric); Manufacturer: Samsung Electro-Mechanics; Manufacturer Part Number: CL10A106MQ8NNNC; Tolerance: ±10%; Value: 10uF / 6.3V; Digi-Key Part Number: 1276-1119-1-ND; Voltage - Rated: 6.3V; Temperature Coefficient: X5R; Operating Temperature: -55°C ~ 85°C; Applications: General Purpose; Package / Case: 0603 (1608 Metric)
C8 C16 C18 = CAP CER 1UF 50V X5R 0603: 1µF ±10% 50V Ceramic Capacitor X5R 0603 (1608 Metric); Manufacturer: Samsung Electro-Mechanics; Value: 1uF / 50V; Digi-Key Part Number: 1276-1860-2-ND; Tolerance: ±10%; Voltage - Rated: 50V; Temperature Coefficient: X5R; Operating Temperature: -55°C ~ 85°C; Applications: General Purpose; Package / Case: 0603 (1608 Metric)
C9-C14 C19 = CAP CER 0.1UF 100V X7R 0603: as C4 on sheet 01_POWER; Value: 0.1uF / 100V; Digi-Key Part Number: 2679-C0603X7R101-104KNPTR-ND; Tolerance: ±10%; Voltage - Rated: 100V; Temperature Coefficient: X7R; Operating Temperature: -55°C ~ 125°C; Applications: General Purpose; Package / Case: 0603 (1608 Metric)
C15 = CAP CER 2.2UF 10V X5R 0603: 2.2 µF ±10% 10V Ceramic Capacitor X5R 0603 (1608 Metric); Manufacturer: CAL-CHIP ELECTRONICS, INC.; Manufacturer Part Number: GMC10X5R225K10NT; Value: 2.2uF/10V; Digi-Key Part Number: 2571-GMC10X5R225K10NTTR-ND; Tolerance: ±10%; Voltage - Rated: 10V; Temperature Coefficient: X5R; Operating Temperature: -55°C ~ 85°C; Applications: General Purpose; Package / Case: 0603 (1608 Metric)
C17 = CAP_CER_470pF_50V_%5_C0G_NP0_ 0603: 470pF ±5% 50V Ceramic Capacitor C0G, NP0 0603 (1608 Metric); Manufacturer: Samsung Electro-Mechanics America, Inc.; Manufacturer Part Number: CL10C471JB8NNNC; Value: 470pF; Digi-Key Part Number: 1276-1168-2-ND; Tolerance: ±5%; Voltage - Rated: 50V; Temperature Coefficient: C0G, NP0; Operating Temperature: -55°C ~ 125°C; Applications: General Purpose; Package / Case: 0603 (1608 Metric); Size / Dimension: 0.063" L x 0.032" W (1.60mm x 0.80mm); Thickness (Max): 0.035" (0.90mm)
C20 = CAP_CER_10nF_50V_%5_ X7R_ 0603: as C1 on sheet 01_POWER; Value: 10nF; Digi-Key Part Number: 311-1778-2-ND; Tolerance: ±5%; Voltage - Rated: 50V; Temperature Coefficient: X7R; Operating Temperature: -55°C ~ 125°C; Applications: General Purpose; Package / Case: 0603 (1608 Metric); Size / Dimension: 0.063" L x 0.032" W (1.60mm x 0.80mm); Thickness (Max): 0.035" (0.90mm)
D46 = LED_GREEN_0805: LED 2X1.2MM 570NM GN WTR CLR SMD; Millicandela Rating: 50mcd; Voltage - Forward (Vf): 2.1V; value: led_green; Digi-Key Part Number: 754-1127-1-ND; Case: 0805; Viewing Angle: -
JTAG = STM_JTAG: STM JTAG Header, 5-Pin; Value: 5-Pin Header 2.54mm
L2-L4 = FERRITE BEAD 30 OHM 0603 1LN: 30 Ohms @ 100 MHz 1 Power Line Ferrite Bead 0603 (1608 Metric) 1A 50mOhm; Manufacturer: Murata Electronics; Manufacturer Part Number: BLM18PG300SN1D; Digi-Key Part Number: 490-1035-1-ND; Operating Temperature: -55°C ~ 125°C; Package / Case: 0603 (1608 Metric); Height (Max): 0.037" (0.95mm); Size / Dimension: 0.063" L x 0.032" W (1.60mm x 0.80mm); DC Resistance (DCR) (Max): 50mOhm; Impedance at Frequency: 30 Ohm @ 100MHz
MH1-MH4 = MH 3MMHOLE_5MMPAD: Mountin hole, NPTH Drill 3mm
R5 = RES_10K_OHM_%5_0.1W_0603: 10 kOhms ±5% 0.1W, 1/10W Chip Resistor 0603 (1608 Metric) Moisture Resistant Thick Film; Manufacturer: Yageo; Manufacturer Part Number: RC0603JR-0710KL; Temperature Coefficient: ±100ppm/°C; Value: 10K; Digi-Key Part Number: 311-10KGRTR-ND; Tolerance: ±5%; Power (Watts): 0.1W, 1/10W; Composition: Thick Film; Operating Temperature: -55°C ~ 155°C; Package / Case: 0603 (1608 Metric); Size / Dimension: 0.063" L x 0.032" W (1.60mm x 0.80mm); Height - Seated (Max): 0.022" (0.55mm); Features: Moisture Resistant
R126 R127 = RES_100K OHM 1% 1/10W 0603: 100 kOhms ±1% 0.1W, 1/10W Chip Resistor 0603 (1608 Metric)  Thick Film; Manufacturer: TE Connectivity Passive Product; Manufacturer Part Number: CRG0603F100K; Temperature Coefficient: ±100ppm/°C; Value: 100K; Digi-Key Part Number: A106046TR-ND; Tolerance: ±1%; Power (Watts): 0.1W, 1/10W; Composition: Thick Film; Operating Temperature: -55°C ~ 155°C; Package / Case: 0603 (1608 Metric); Size / Dimension: 0.063" L x 0.032" W (1.60mm x 0.80mm); Height - Seated (Max): 0.022" (0.55mm); Features: Automotive AEC-Q200
R128 = RES_560_OHM_%5_0.1W_0603: 560 Ohms ±5% 0.1W, 1/10W Chip Resistor 0603 (1608 Metric) Moisture Resistant Thick Film; Manufacturer: Yageo; Manufacturer Part Number: RC0603JR-07560RL; Temperature Coefficient: ±100ppm/°C; Value: 560R; Digi-Key Part Number: 311-560GRCT-ND; Tolerance: ±5%; Power (Watts): 0.1W, 1/10W; Composition: Thick Film; Operating Temperature: -55°C ~ 155°C; Package / Case: 0603 (1608 Metric); Size / Dimension: 0.063" L x 0.032" W (1.60mm x 0.80mm); Height - Seated (Max): 0.022" (0.55mm); Features: Moisture Resistant
SW_RST = SW_TACTILE_6x6x4.3mm SMT: Tactile Switch SPST-NO Top Actuated Surface Mount; Switch Function: Off-Mom; Value: switch tactile; Digi-Key Part Number: CKN9112TR-ND; case: 6.00mm x 6.00mm_H4.30mm
U2 = IC MCU 32BIT 256KB FLASH 32KB RAM 128LQFP M251KG6AE: ARM® Cortex®-M23 series Microcontroller IC 32-Bit 48MHz 256KB (256K x 8) FLASH 128-LQFP (14x14); Voltage - Supply (Vcc/Vdd): 1.75V ~ 5.5V; Oscillator Type: Internal; Value: M251KG6AE; Core Processor: ARM® Cortex®-M23; Speed: 48MHz; Package / Case: 128-LQFP (14x14); Operating Temperature: -40°C ~ 105°C (TA); Digi-Key Part Number: https://www.ozdisan.com/integrated-circuits-ics/embedded-ics/microcontrollers/M251KG6AE

## Sheet 03_PHOTOELECTRIC_SENSOR.SchDoc
size A3
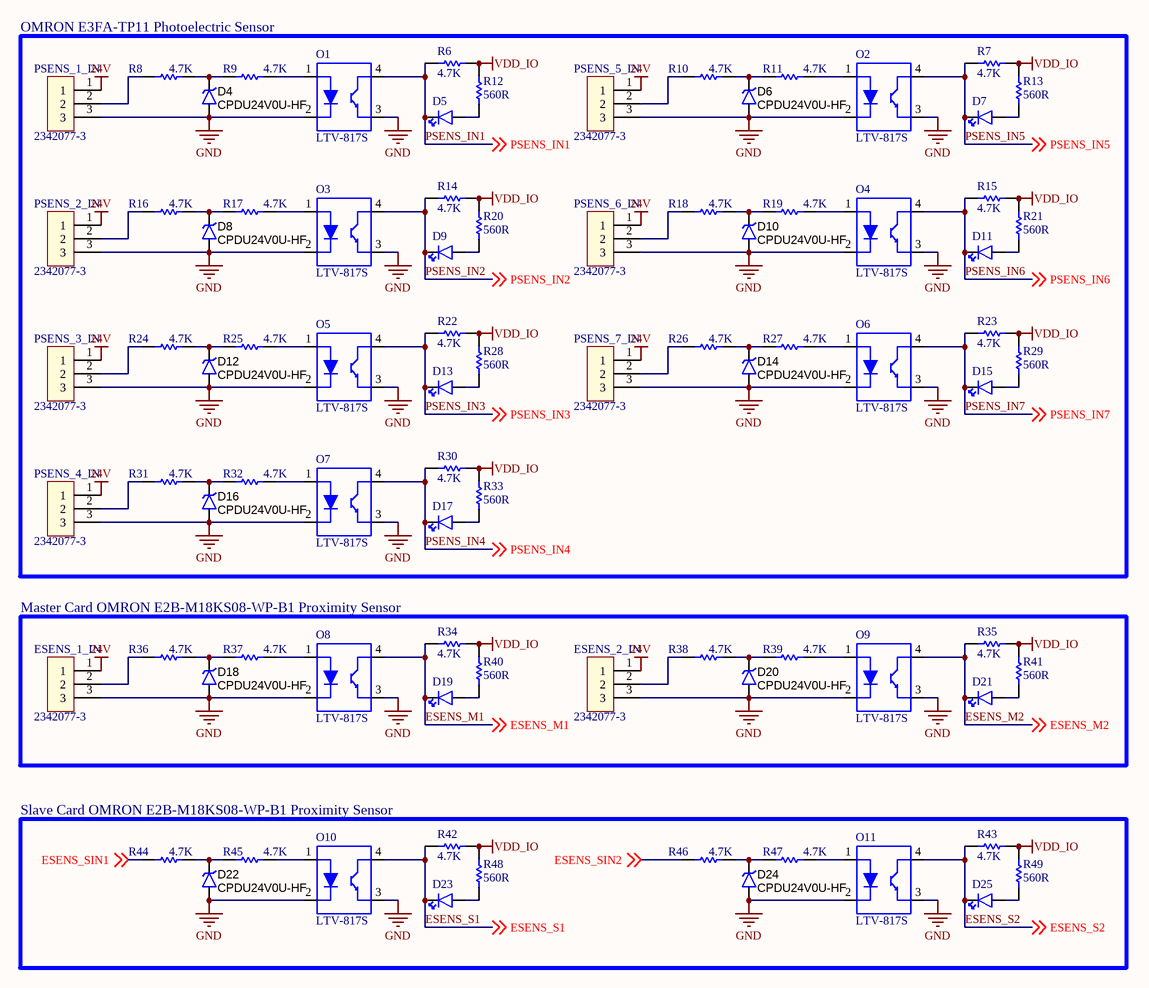
[diagram p2: 03_PHOTOELECTRIC_SENSOR.SchDoc]

### Parts
D4  CPDU24V0U-HF  [SOD523F]
D5  led_green  [805LED]  (value not drawn)
D6  CPDU24V0U-HF  [SOD523F]
D7  led_green  [805LED]  (value not drawn)
D8  CPDU24V0U-HF  [SOD523F]
D9  led_green  [805LED]  (value not drawn)
D10  CPDU24V0U-HF  [SOD523F]
D11  led_green  [805LED]  (value not drawn)
D12  CPDU24V0U-HF  [SOD523F]
D13  led_green  [805LED]  (value not drawn)
D14  CPDU24V0U-HF  [SOD523F]
D15  led_green  [805LED]  (value not drawn)
D16  CPDU24V0U-HF  [SOD523F]
D17  led_green  [805LED]  (value not drawn)
D18  CPDU24V0U-HF  [SOD523F]
D19  led_green  [805LED]  (value not drawn)
D20  CPDU24V0U-HF  [SOD523F]
D21  led_green  [805LED]  (value not drawn)
D22  CPDU24V0U-HF  [SOD523F]
D23  led_green  [805LED]  (value not drawn)
D24  CPDU24V0U-HF  [SOD523F]
D25  led_green  [805LED]  (value not drawn)
ESENS_1_IN  2342077-3  [TERM BLOCK HDR 3POS 90DEG PITCH 3.81MM]
ESENS_2_IN  2342077-3  [TERM BLOCK HDR 3POS 90DEG PITCH 3.81MM]
O1  LTV-817S  [SMD4-2.54-4.6X6.5MM]
O2  LTV-817S  [SMD4-2.54-4.6X6.5MM]
O3  LTV-817S  [SMD4-2.54-4.6X6.5MM]
O4  LTV-817S  [SMD4-2.54-4.6X6.5MM]
O5  LTV-817S  [SMD4-2.54-4.6X6.5MM]
O6  LTV-817S  [SMD4-2.54-4.6X6.5MM]
O7  LTV-817S  [SMD4-2.54-4.6X6.5MM]
O8  LTV-817S  [SMD4-2.54-4.6X6.5MM]
O9  LTV-817S  [SMD4-2.54-4.6X6.5MM]
O10  LTV-817S  [SMD4-2.54-4.6X6.5MM]
O11  LTV-817S  [SMD4-2.54-4.6X6.5MM]
PSENS_1_IN  2342077-3  [TERM BLOCK HDR 3POS 90DEG PITCH 3.81MM]
PSENS_2_IN  2342077-3  [TERM BLOCK HDR 3POS 90DEG PITCH 3.81MM]
PSENS_3_IN  2342077-3  [TERM BLOCK HDR 3POS 90DEG PITCH 3.81MM]
PSENS_4_IN  2342077-3  [TERM BLOCK HDR 3POS 90DEG PITCH 3.81MM]
PSENS_5_IN  2342077-3  [TERM BLOCK HDR 3POS 90DEG PITCH 3.81MM]
PSENS_6_IN  2342077-3  [TERM BLOCK HDR 3POS 90DEG PITCH 3.81MM]
PSENS_7_IN  2342077-3  [TERM BLOCK HDR 3POS 90DEG PITCH 3.81MM]
R6  4.7K  [603R]
R7  4.7K  [603R]
R8  4.7K  [603R]
R9  4.7K  [603R]
R10  4.7K  [603R]
R11  4.7K  [603R]
R12  560R  [603R]
R13  560R  [603R]
R14  4.7K  [603R]
R15  4.7K  [603R]
R16  4.7K  [603R]
R17  4.7K  [603R]
R18  4.7K  [603R]
R19  4.7K  [603R]
R20  560R  [603R]
R21  560R  [603R]
R22  4.7K  [603R]
R23  4.7K  [603R]
R24  4.7K  [603R]
R25  4.7K  [603R]
R26  4.7K  [603R]
R27  4.7K  [603R]
R28  560R  [603R]
R29  560R  [603R]
R30  4.7K  [603R]
R31  4.7K  [603R]
R32  4.7K  [603R]
R33  560R  [603R]
R34  4.7K  [603R]
R35  4.7K  [603R]
R36  4.7K  [603R]
R37  4.7K  [603R]
R38  4.7K  [603R]
R39  4.7K  [603R]
R40  560R  [603R]
R41  560R  [603R]
R42  4.7K  [603R]
R43  4.7K  [603R]
R44  4.7K  [603R]
R45  4.7K  [603R]
R46  4.7K  [603R]
R47  4.7K  [603R]
R48  560R  [603R]
R49  560R  [603R]

### Blocks framed on the sheet
OMRON E3FA-TP11 Photoelectric Sensor: D4-D17 O1-O7 PSENS_1_IN PSENS_2_IN PSENS_3_IN PSENS_4_IN PSENS_5_IN PSENS_6_IN PSENS_7_IN R6-R33
Master Card OMRON E2B-M18KS08-WP-B1 Proximity Sensor: D18-D21 ESENS_1_IN ESENS_2_IN O8 O9 R34-R41
Slave Card OMRON E2B-M18KS08-WP-B1 Proximity Sensor: D22-D25 O10 O11 R42-R49

### Nets
24V: ESENS_1_IN.1 ESENS_2_IN.1 PSENS_1_IN.1 PSENS_2_IN.1 PSENS_3_IN.1 PSENS_4_IN.1 PSENS_5_IN.1 PSENS_6_IN.1 PSENS_7_IN.1
GND: D4.1 D6.1 D8.1 D10.1 D12.1 D14.1 D16.1 D18.1 D20.1 D22.1 D24.1 ESENS_1_IN.3 ESENS_2_IN.3 O1.2(CATHODE) O1.3(EMITER) O2.2(CATHODE) O2.3(EMITER) O3.2(CATHODE) O3.3(EMITER) O4.2(CATHODE) O4.3(EMITER) O5.2(CATHODE) O5.3(EMITER) O6.2(CATHODE) O6.3(EMITER) O7.2(CATHODE) O7.3(EMITER) O8.2(CATHODE) O8.3(EMITER) O9.2(CATHODE) O9.3(EMITER) O10.2(CATHODE) O10.3(EMITER) O11.2(CATHODE) O11.3(EMITER) PSENS_1_IN.3 PSENS_2_IN.3 PSENS_3_IN.3 PSENS_4_IN.3 PSENS_5_IN.3 PSENS_6_IN.3 PSENS_7_IN.3
VDD_IO: R6.2 R7.2 R12.2 R13.2 R14.2 R15.2 R20.2 R21.2 R22.2 R23.2 R28.2 R29.2 R30.2 R33.2 R34.2 R35.2 R40.2 R41.2 R42.2 R43.2 R48.2 R49.2  [project net 5V]
ESENS_M1: D19.2(K) O8.4(COLLECTOR) R34.1 ; off-sheet ESENS_M1
ESENS_M2: D21.2(K) O9.4(COLLECTOR) R35.1 ; off-sheet ESENS_M2
ESENS_S1: D23.2(K) O10.4(COLLECTOR) R42.1 ; off-sheet ESENS_S1
ESENS_S2: D25.2(K) O11.4(COLLECTOR) R43.1 ; off-sheet ESENS_S2
ESENS_SIN1: R44.1 ; off-sheet ESENS_SIN1
ESENS_SIN2: R46.1 ; off-sheet ESENS_SIN2
PSENS_IN1: D5.2(K) O1.4(COLLECTOR) R6.1 ; off-sheet PSENS_IN1
PSENS_IN2: D9.2(K) O3.4(COLLECTOR) R14.1 ; off-sheet PSENS_IN2
PSENS_IN3: D13.2(K) O5.4(COLLECTOR) R22.1 ; off-sheet PSENS_IN3
PSENS_IN4: D17.2(K) O7.4(COLLECTOR) R30.1 ; off-sheet PSENS_IN4
PSENS_IN5: D7.2(K) O2.4(COLLECTOR) R7.1 ; off-sheet PSENS_IN5
PSENS_IN6: D11.2(K) O4.4(COLLECTOR) R15.1 ; off-sheet PSENS_IN6
PSENS_IN7: D15.2(K) O6.4(COLLECTOR) R23.1 ; off-sheet PSENS_IN7
NetD4_2: D4.2 R8.2 R9.1
NetD5_1: D5.1(A) R12.1
NetD6_2: D6.2 R10.2 R11.1
NetD7_1: D7.1(A) R13.1
NetD8_2: D8.2 R16.2 R17.1
NetD9_1: D9.1(A) R20.1
NetD10_2: D10.2 R18.2 R19.1
NetD11_1: D11.1(A) R21.1
NetD12_2: D12.2 R24.2 R25.1
NetD13_1: D13.1(A) R28.1
NetD14_2: D14.2 R26.2 R27.1
NetD15_1: D15.1(A) R29.1
NetD16_2: D16.2 R31.2 R32.1
NetD17_1: D17.1(A) R33.1
NetD18_2: D18.2 R36.2 R37.1
NetD19_1: D19.1(A) R40.1
NetD20_2: D20.2 R38.2 R39.1
NetD21_1: D21.1(A) R41.1
NetD22_2: D22.2 R44.2 R45.1
NetD23_1: D23.1(A) R48.1
NetD24_2: D24.2 R46.2 R47.1
NetD25_1: D25.1(A) R49.1
NetESENS_1_IN_2: ESENS_1_IN.2 R36.1
NetESENS_2_IN_2: ESENS_2_IN.2 R38.1
NetO1_1: O1.1(ANODE) R9.2
NetO2_1: O2.1(ANODE) R11.2
NetO3_1: O3.1(ANODE) R17.2
NetO4_1: O4.1(ANODE) R19.2
NetO5_1: O5.1(ANODE) R25.2
NetO6_1: O6.1(ANODE) R27.2
NetO7_1: O7.1(ANODE) R32.2
NetO8_1: O8.1(ANODE) R37.2
NetO9_1: O9.1(ANODE) R39.2
NetO10_1: O10.1(ANODE) R45.2
NetO11_1: O11.1(ANODE) R47.2
NetPSENS_1_IN_2: PSENS_1_IN.2 R8.1
NetPSENS_2_IN_2: PSENS_2_IN.2 R16.1
NetPSENS_3_IN_2: PSENS_3_IN.2 R24.1
NetPSENS_4_IN_2: PSENS_4_IN.2 R31.1
NetPSENS_5_IN_2: PSENS_5_IN.2 R10.1
NetPSENS_6_IN_2: PSENS_6_IN.2 R18.1
NetPSENS_7_IN_2: PSENS_7_IN.2 R26.1

### Library data of the parts
D4 D6 D8 D10 D12 D14 D16 D18 D20 D22 D24 = TVS DIODE 24VWM 50V 0603/SOD523F CPDU24V0U-HF: 50V Clamp 3A (8/20µs) Ipp Tvs Diode Surface Mount 0603/SOD-523F; Manufacturer: Comchip Technology; Type: Zener; Voltage - Reverse Standoff (Typ): 24V (Max); Voltage - Breakdown (Min): 26.5V; Power - Peak Pulse: 150W; Power Line Protection: No; Unidirectional Channels: 1; Digi-Key Part Number: 641-1679-1-ND; Manufacturer Part Number: CPDU24V0U-HF; Voltage - Clamping (Max) @ Ipp: 50V; Operating Temperature: -55°C ~ 125°C (TJ); Package / Case: 0603/SOD-523F; Value: CPDU24V0U-HF
D5 D7 D9 D11 D13 D15 D17 D19 D21 D23 D25 = LED_GREEN_0805: as D46 on sheet 02_CPU; value: led_green; Digi-Key Part Number: 754-1127-1-ND; Case: 0805; Viewing Angle: -
ESENS_1_IN ESENS_2_IN PSENS_1_IN PSENS_2_IN PSENS_3_IN PSENS_4_IN PSENS_5_IN PSENS_6_IN PSENS_7_IN = TERM BLOCK HDR 3POS 90DEG 3.81MM: 3 Position Terminal Block Header, Male Pins, Shrouded (4 Side) 0.150" (3.81mm) 90°, Right Angle - Through Hole; Manufacturer: TE Connectivity AMP Connectors; Contact Tail Length: 0.075" (1.90mm); Digi-Key Part Number: A145322-ND; Value: 2342077-3; Pitch: 0.150" (3.81mm); Header Orientation: 90°, Right Angle; Insulation Height: 0.285" (7.25mm)
O1-O11 = OPTOISOLATR 5KV TRANSISTOR 4-SMD LTV-817S: Optoisolator Transistor Output 5000Vrms 1 Channel 4-SMD; Voltage - Output (Max): 35V; Number of Channels: 1; Rise / Fall Time (Typ): 4µs, 3µs; Current - DC Forward (If) (Max): 50 mA; Voltage - Forward (Vf) (Typ): 1.2V; Output Type: Transistor; Voltage - Isolation: 5000Vrms; Package / Case: 4-SMD, Gull Wing; Operating Temperature: -30°C ~ 110°C; Value: LTV-817S; Digi-Key Part Number: 160-1367-5-ND
R6-R11 R14-R19 R22-R27 R30-R32 R34-R39 R42-R47 = RES_4.7K_OHM_%5_0.1W_0603: 4.7 kOhms ±5% 0.1W, 1/10W Chip Resistor 0603 (1608 Metric) Moisture Resistant Thick Film; Manufacturer: Yageo; Manufacturer Part Number: RC0603JR-074K7L; Temperature Coefficient: ±100ppm/°C; Value: 4.7K; Digi-Key Part Number: 311-4.7KGRTR-ND; Tolerance: ±5%; Power (Watts): 0.1W, 1/10W; Composition: Thick Film; Operating Temperature: -55°C ~ 155°C; Package / Case: 0603 (1608 Metric); Size / Dimension: 0.063" L x 0.032" W (1.60mm x 0.80mm); Height - Seated (Max): 0.022" (0.55mm); Features: Moisture Resistant
R12 R13 R20 R21 R28 R29 R33 R40 R41 R48 R49 = RES_560_OHM_%5_0.1W_0603: as R128 on sheet 02_CPU; Value: 560R; Digi-Key Part Number: 311-560GRCT-ND; Tolerance: ±5%; Power (Watts): 0.1W, 1/10W; Composition: Thick Film; Operating Temperature: -55°C ~ 155°C; Package / Case: 0603 (1608 Metric); Size / Dimension: 0.063" L x 0.032" W (1.60mm x 0.80mm); Height - Seated (Max): 0.022" (0.55mm); Features: Moisture Resistant

## Sheet 04_GIRIS_CIKIS_EMG_BUTTONS.SchDoc
size A3
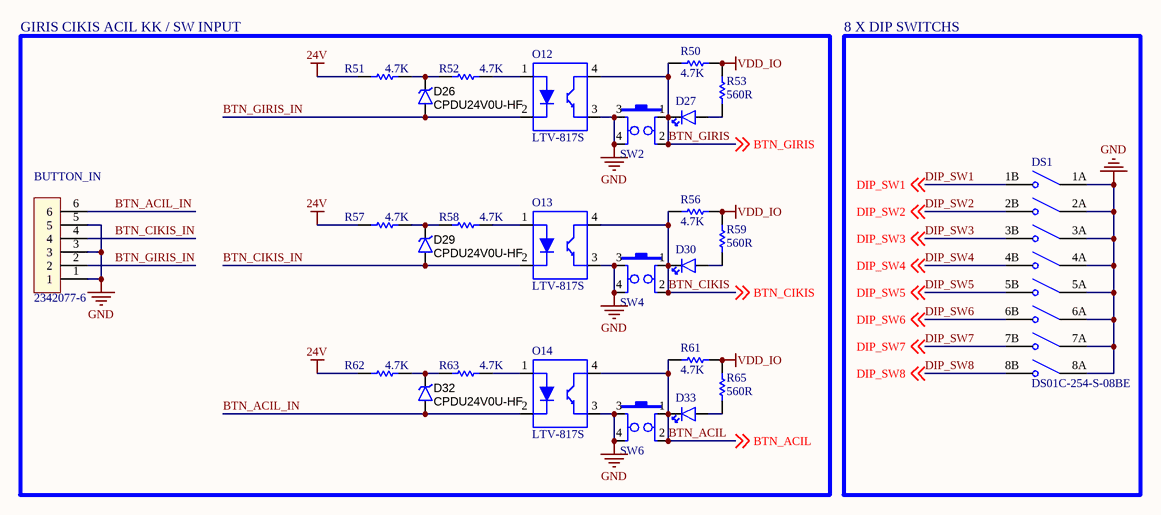
[diagram p3: 04_GIRIS_CIKIS_EMG_BUTTONS.SchDoc]

### Parts
BUTTON_IN  2342077-6  [TERM BLOCK HDR 6POS 90DEG PITCH 3.81MM]
D26  CPDU24V0U-HF  [SOD523F]
D27  led_green  [805LED]  (value not drawn)
D29  CPDU24V0U-HF  [SOD523F]
D30  led_green  [805LED]  (value not drawn)
D32  CPDU24V0U-HF  [SOD523F]
D33  led_green  [805LED]  (value not drawn)
DS1  DS01C-254-S-08BE  [SW_DS01C-254-S-08BE]
O12  LTV-817S  [SMD4-2.54-4.6X6.5MM]
O13  LTV-817S  [SMD4-2.54-4.6X6.5MM]
O14  LTV-817S  [SMD4-2.54-4.6X6.5MM]
R50  4.7K  [603R]
R51  4.7K  [603R]
R52  4.7K  [603R]
R53  560R  [603R]
R56  4.7K  [603R]
R57  4.7K  [603R]
R58  4.7K  [603R]
R59  560R  [603R]
R61  4.7K  [603R]
R62  4.7K  [603R]
R63  4.7K  [603R]
R65  560R  [603R]
SW2  switch tactile  [SW_TACTILE_6X6mm SMT]  (value not drawn)
SW4  switch tactile  [SW_TACTILE_6X6mm SMT]  (value not drawn)
SW6  switch tactile  [SW_TACTILE_6X6mm SMT]  (value not drawn)

### Blocks framed on the sheet
GIRIS CIKIS ACIL KK / SW INPUT: BUTTON_IN D26 D27 D29 D30 D32 D33 O12-O14 R50-R53 R56-R59 R61-R63 R65 SW2 SW4 SW6
8 X DIP SWITCHS: DS1

### Nets
24V: R51.1 R57.1 R62.1
GND: BUTTON_IN.1 BUTTON_IN.3 BUTTON_IN.5 DS1.1A(COM1) DS1.2A(COM2) DS1.3A(COM3) DS1.4A(COM4) DS1.5A(COM5) DS1.6A(COM6) DS1.7A(COM7) DS1.8A(COM8) O12.3(EMITER) O13.3(EMITER) O14.3(EMITER) SW2.3 SW2.4 SW4.3 SW4.4 SW6.3 SW6.4
VDD_IO: R50.2 R53.2 R56.2 R59.2 R61.2 R65.2  [project net 5V]
BTN_ACIL: D33.2(K) O14.4(COLLECTOR) R61.1 SW6.1 SW6.2 ; off-sheet BTN_ACIL
BTN_ACIL_IN: BUTTON_IN.6 D32.1 O14.2(CATHODE)
BTN_CIKIS: D30.2(K) O13.4(COLLECTOR) R56.1 SW4.1 SW4.2 ; off-sheet BTN_CIKIS
BTN_CIKIS_IN: BUTTON_IN.4 D29.1 O13.2(CATHODE)
BTN_GIRIS: D27.2(K) O12.4(COLLECTOR) R50.1 SW2.1 SW2.2 ; off-sheet BTN_GIRIS
BTN_GIRIS_IN: BUTTON_IN.2 D26.1 O12.2(CATHODE)
DIP_SW1: DS1.1B(NO1) ; off-sheet DIP_SW1
DIP_SW2: DS1.2B(NO2) ; off-sheet DIP_SW2
DIP_SW3: DS1.3B(NO3) ; off-sheet DIP_SW3
DIP_SW4: DS1.4B(NO4) ; off-sheet DIP_SW4
DIP_SW5: DS1.5B(NO5) ; off-sheet DIP_SW5
DIP_SW6: DS1.6B(NO6) ; off-sheet DIP_SW6
DIP_SW7: DS1.7B(NO7) ; off-sheet DIP_SW7
DIP_SW8: DS1.8B(NO8) ; off-sheet DIP_SW8
NetD26_2: D26.2 R51.2 R52.1
NetD27_1: D27.1(A) R53.1
NetD29_2: D29.2 R57.2 R58.1
NetD30_1: D30.1(A) R59.1
NetD32_2: D32.2 R62.2 R63.1
NetD33_1: D33.1(A) R65.1
NetO12_1: O12.1(ANODE) R52.2
NetO13_1: O13.1(ANODE) R58.2
NetO14_1: O14.1(ANODE) R63.2

### Library data of the parts
BUTTON_IN = TERM BLOCK HDR 6POS 90DEG 3.81MM: 6 Position Terminal Block Header, Male Pins, Shrouded (4 Side) 0.150" (3.81mm) 90°, Right Angle - Through Hole; Manufacturer: TE Connectivity AMP Connectors; Contact Tail Length: 0.075" (1.90mm); Digi-Key Part Number: A145325-ND; Value: 2342077-6; Pitch: 0.150" (3.81mm); Header Orientation: 90°, Right Angle; Insulation Height: 0.285" (7.25mm)
D26 D29 D32 = TVS DIODE 24VWM 50V 0603/SOD523F CPDU24V0U-HF: as D4 on sheet 03_PHOTOELECTRIC_SENSOR; Digi-Key Part Number: 641-1679-1-ND; Manufacturer Part Number: CPDU24V0U-HF; Voltage - Clamping (Max) @ Ipp: 50V; Operating Temperature: -55°C ~ 125°C (TJ); Package / Case: 0603/SOD-523F; Value: CPDU24V0U-HF
D27 D30 D33 = LED_GREEN_0805: as D46 on sheet 02_CPU; value: led_green; Digi-Key Part Number: 754-1127-1-ND; Case: 0805; Viewing Angle: -
DS1 = DIP SWITCH, SPST, 2.54 PITCH, RA DS01C-254-S-08BE: Dip Switch SPST 8 Position Through Hole Slide (Standard) Actuator 25mA 24VDC; Digi-Key Part Number: 2223-DS01C-254-S-08BE-ND; Value: DS01C-254-S-08BE
O12-O14 = OPTOISOLATR 5KV TRANSISTOR 4-SMD LTV-817S: as O1 on sheet 03_PHOTOELECTRIC_SENSOR; Output Type: Transistor; Voltage - Isolation: 5000Vrms; Package / Case: 4-SMD, Gull Wing; Operating Temperature: -30°C ~ 110°C; Value: LTV-817S; Digi-Key Part Number: 160-1367-5-ND
R50-R52 R56-R58 R61-R63 = RES_4.7K_OHM_%5_0.1W_0603: as R6 on sheet 03_PHOTOELECTRIC_SENSOR; Value: 4.7K; Digi-Key Part Number: 311-4.7KGRTR-ND; Tolerance: ±5%; Power (Watts): 0.1W, 1/10W; Composition: Thick Film; Operating Temperature: -55°C ~ 155°C; Package / Case: 0603 (1608 Metric); Size / Dimension: 0.063" L x 0.032" W (1.60mm x 0.80mm); Height - Seated (Max): 0.022" (0.55mm); Features: Moisture Resistant
R53 R59 R65 = RES_560_OHM_%5_0.1W_0603: as R128 on sheet 02_CPU; Value: 560R; Digi-Key Part Number: 311-560GRCT-ND; Tolerance: ±5%; Power (Watts): 0.1W, 1/10W; Composition: Thick Film; Operating Temperature: -55°C ~ 155°C; Package / Case: 0603 (1608 Metric); Size / Dimension: 0.063" L x 0.032" W (1.60mm x 0.80mm); Height - Seated (Max): 0.022" (0.55mm); Features: Moisture Resistant
SW2 SW4 SW6 = SW_TACTILE_6x6x4.3mm SMT: as SW_RST on sheet 02_CPU; Value: switch tactile; Digi-Key Part Number: CKN9112TR-ND; case: 6.00mm x 6.00mm_H4.30mm

## Sheet 05_FEEDBACK_OUTPUTS.SchDoc
size A3
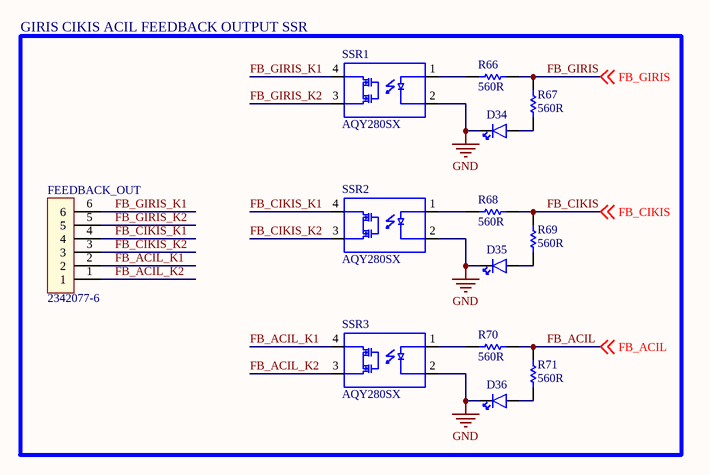
[diagram p4: 05_FEEDBACK_OUTPUTS.SchDoc]

### Parts
D34  led_green  [805LED]  (value not drawn)
D35  led_green  [805LED]  (value not drawn)
D36  led_green  [805LED]  (value not drawn)
FEEDBACK_OUT  2342077-6  [TERM BLOCK HDR 6POS 90DEG PITCH 3.81MM]
R66  560R  [603R]
R67  560R  [603R]
R68  560R  [603R]
R69  560R  [603R]
R70  560R  [603R]
R71  560R  [603R]
SSR1  AQY280SX  [SOP254P680X220-4N]
SSR2  AQY280SX  [SOP254P680X220-4N]
SSR3  AQY280SX  [SOP254P680X220-4N]

### Blocks framed on the sheet
GIRIS CIKIS ACIL FEEDBACK OUTPUT SSR: D34-D36 FEEDBACK_OUT R66-R71 SSR1-SSR3

### Nets
GND: D34.2(K) D35.2(K) D36.2(K) SSR1.2 SSR2.2 SSR3.2
FB_ACIL: R70.1 R71.2 ; off-sheet FB_ACIL
FB_ACIL_K1: FEEDBACK_OUT.2 SSR3.4
FB_ACIL_K2: FEEDBACK_OUT.1 SSR3.3
FB_CIKIS: R68.1 R69.2 ; off-sheet FB_CIKIS
FB_CIKIS_K1: FEEDBACK_OUT.4 SSR2.4
FB_CIKIS_K2: FEEDBACK_OUT.3 SSR2.3
FB_GIRIS: R66.1 R67.2 ; off-sheet FB_GIRIS
FB_GIRIS_K1: FEEDBACK_OUT.6 SSR1.4
FB_GIRIS_K2: FEEDBACK_OUT.5 SSR1.3
NetD34_1: D34.1(A) R67.1
NetD35_1: D35.1(A) R69.1
NetD36_1: D36.1(A) R71.1
NetR66_2: R66.2 SSR1.1
NetR68_2: R68.2 SSR2.1
NetR70_2: R70.2 SSR3.1

### Library data of the parts
D34-D36 = LED_GREEN_0805: as D46 on sheet 02_CPU; value: led_green; Digi-Key Part Number: 754-1127-1-ND; Case: 0805; Viewing Angle: -
FEEDBACK_OUT = TERM BLOCK HDR 6POS 90DEG 3.81MM: as BUTTON_IN on sheet 04_GIRIS_CIKIS_EMG_BUTTONS; Digi-Key Part Number: A145325-ND; Value: 2342077-6; Pitch: 0.150" (3.81mm); Header Orientation: 90°, Right Angle; Insulation Height: 0.285" (7.25mm)
R66-R71 = RES_560_OHM_%5_0.1W_0603: as R128 on sheet 02_CPU; Value: 560R; Digi-Key Part Number: 311-560GRCT-ND; Tolerance: ±5%; Power (Watts): 0.1W, 1/10W; Composition: Thick Film; Operating Temperature: -55°C ~ 155°C; Package / Case: 0603 (1608 Metric); Size / Dimension: 0.063" L x 0.032" W (1.60mm x 0.80mm); Height - Seated (Max): 0.022" (0.55mm); Features: Moisture Resistant
SSR1-SSR3 = SSR RELAY SPST-NO 120MA 0-350V AQY280SX: Solid State SPST-NO (1 Form A) AC/DC 0-350V 150mA 4-SOP (0.173", 4.40mm); Manufacturer: Panasonic Electric Works; Output Type: AC, DC; Voltage - Input: 1.14VDC; Voltage - Load: 0 V ~ 350 V; Load Current: 120 mA; On-State Resistance (Max): 25 Ohms; Digi-Key Part Number: 255-3913-1-ND; Value: AQY280SX; Circuit: SPST-NO (1 Form A); Package / Case: 4-SOP (0.173", 4.40mm)